# Altium project RHC12-BTA.PrjPcb
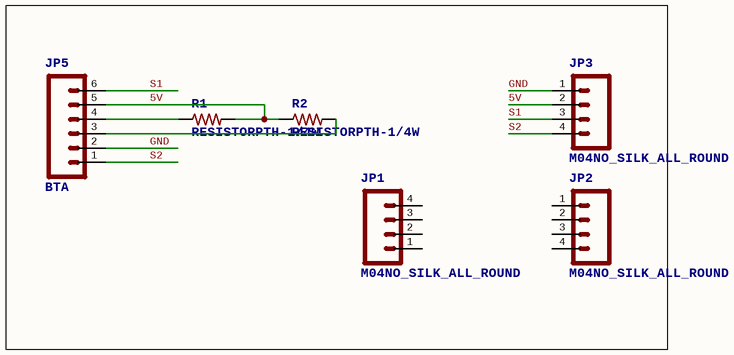
[diagram p0: RHC12-BTA.SchDoc]
1 sheet, 6 parts. Net scope: global (net labels, ports and power ports of the same name join across sheets).
Board file: RHC12-BTA.PcbDoc

## Sheet RHC12-BTA.SchDoc
size 117 x 60 mm

### Parts
JP1  M04NO_SILK_ALL_ROUND  [1X04_NO_SILK_ALL_ROUND]
JP2  M04NO_SILK_ALL_ROUND  [1X04_NO_SILK_ALL_ROUND]
JP3  M04NO_SILK_ALL_ROUND  [1X04_NO_SILK_ALL_ROUND]
JP5  BTA  [BTA]
R1  RESISTORPTH-1/4W  [AXIAL-0.4]
R2  RESISTORPTH-1/4W  [AXIAL-0.4]

### Nets
5V: JP3.2 JP5.5 R1.P$2 R2.P$1
GND: JP3.1 JP5.2
S1: JP3.3 JP5.6
S2: JP3.4 JP5.1
NetJP5_3: JP5.3 R2.P$2
NetJP5_4: JP5.4 R1.P$1

Not connected (* = marked no-connect by the designer): JP1 1 2 3 4; JP2 1 2 3 4

### Library data of the parts
JP1-JP3 = M04NO_SILK_ALL_ROUND: Header 4Standard 4-pin 0.1" header. Use with straight break away headers (SKU : PRT-00116), right angle break away headers (PRT-00553), swiss pins (PRT-00743), machine pins (PRT-00117), and female headers (PRT-00115). Molex polarized connector foot print use with SKU : PRT-08231 with associated crimp pins and housings. 1MM SMD Version SKU: PRT-10208
JP5 = M06VERNIER-ANALOG: Header 6 Standard 6-pin 0.1" header. Use with straight break away headers (SKU : PRT-00116), right angle break away headers (PRT-00553), swiss pins (PRT-00743), machine pins (PRT-00117), and female headers (PRT-00115). Molex polarized connector foot print use with SKU : PRT-08094 with associated crimp pins and housings.   NOTES ON THE VARIANTS LOCK and LOCK_LONGPADS... This footprint was designed to help hold the alignment of a through-hole component (i.e.  6-pin header) while soldering it into place. You may notice that each hole has been shifted either up or down by 0.005 of an inch from it's more standard position (which is a perfectly straight line).  This slight alteration caused the pins (the squares in the middle) to touch the edges of the holes.  Because they are alternating, it causes a "brace" to hold the component in place.  0.005 has proven to be the perfect amount of "off-center" position when using our standard breakaway headers. Although looks a little odd when you look at the bare footprint, once you have a header in there, the alteration is very hard to notice.  Also,if you push a header all the way into place, it is covered up entirely on the bottom side.  This idea of altering the position of holes to aid alignment will be further integrated into the Sparkfun Library for other footprints.  It can help hold any component with 3 or more connection pins.
R1 R2 = RESISTORPTH-1/4W: ResistorBasic schematic elements and footprints for 0603, 1206, and PTH resistors.